# EAGLE design sensors (EAGLE 5.11)
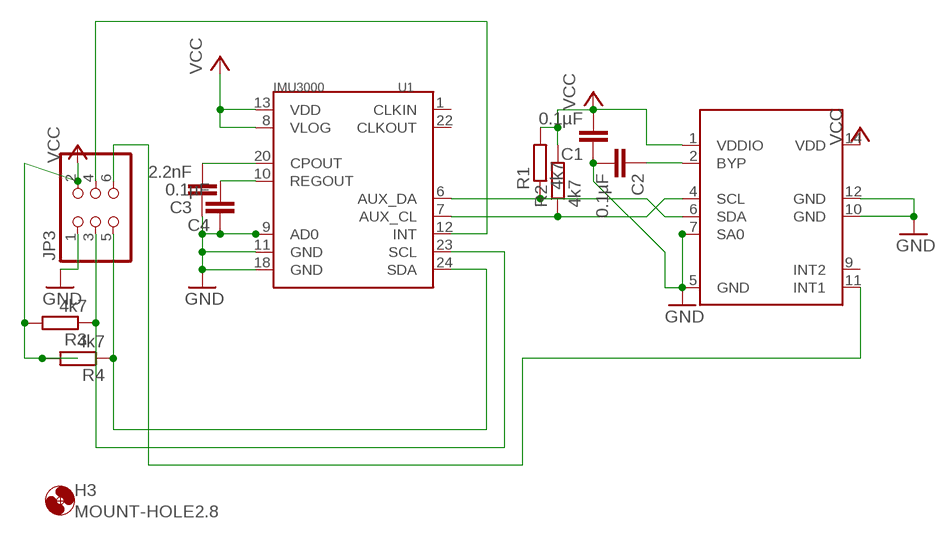
[diagram p0: schematic, sheet 1]

## Parts
C1  0.1µF  C-EUC0805  [C0805]
C2  0.1µF  C-EUC0805  [C0805]
C3  2.2nF  C-EUC0805  [C0805]
C4  0.1µF  C-EUC0805  [C0805]
H3  MOUNT-HOLE2.8  [2,8]
JP3  PINHD-2X3/90  [2X03/90]
R1  4k7  R-EU_R0805  [R0805]
R2  4k7  R-EU_R1206W  [R1206W]
R3  4k7  R-EU_R0805  [R0805]
R4  4k7  R-EU_R0805  [R0805]
U1  IMU3000  [QFN-24]
U2  MMA8451Q  [QFN16-4X4]

## Nets
GND: C1.1 C2.2 C3.1 C4.1 JP3.1 U1.9(AD0) U1.11(GND) U1.18(GND) U2.5(GND) U2.7(SA0) U2.10(GND) U2.12(GND)
N$1: R1.1 U1.6(AUX_DA) U2.6(SDA)
N$2: R2.1 U1.7(AUX_CL) U2.4(SCL)
N$4: C2.1 U2.2(BYP)
N$5: JP3.6 U2.11(INT1)
N$7: C3.2 U1.20(CPOUT)
N$8: C4.2 U1.10(REGOUT)
N$9: JP3.3 R3.1 U1.23(SCL)
N$10: JP3.5 R4.1 U1.24(SDA)
N$11: JP3.4 U1.12(INT)
VCC: C1.2 JP3.2 R1.2 R2.2 R3.2 R4.2 U1.8(VLOG) U1.13(VDD) U2.1(VDDIO) U2.14(VDD)
Unconnected: U1.1(CLKIN) U1.22(CLKOUT) U2.9(INT2)

## Library data of the parts
C1-C4 = rcl:C-EU: CAPACITOR, European symbol
H3 = holes:MOUNT-HOLE: MOUNTING HOLE with drill center marker
JP3 = pinhead:PINHD-2X3: PIN HEADER
R1-R4 = rcl:R-EU_: RESISTOR, European symbol
U1 = Quadro:IMU3000
U2 = Quadro:MMA8451Q

## Board
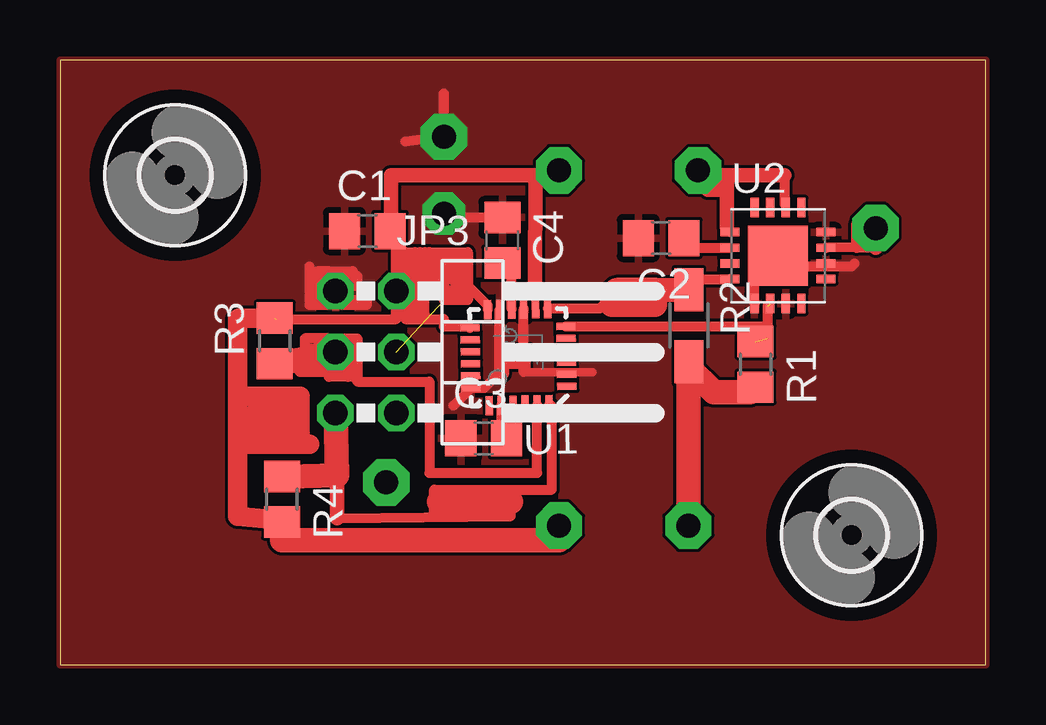
[diagram p1: board, top side]
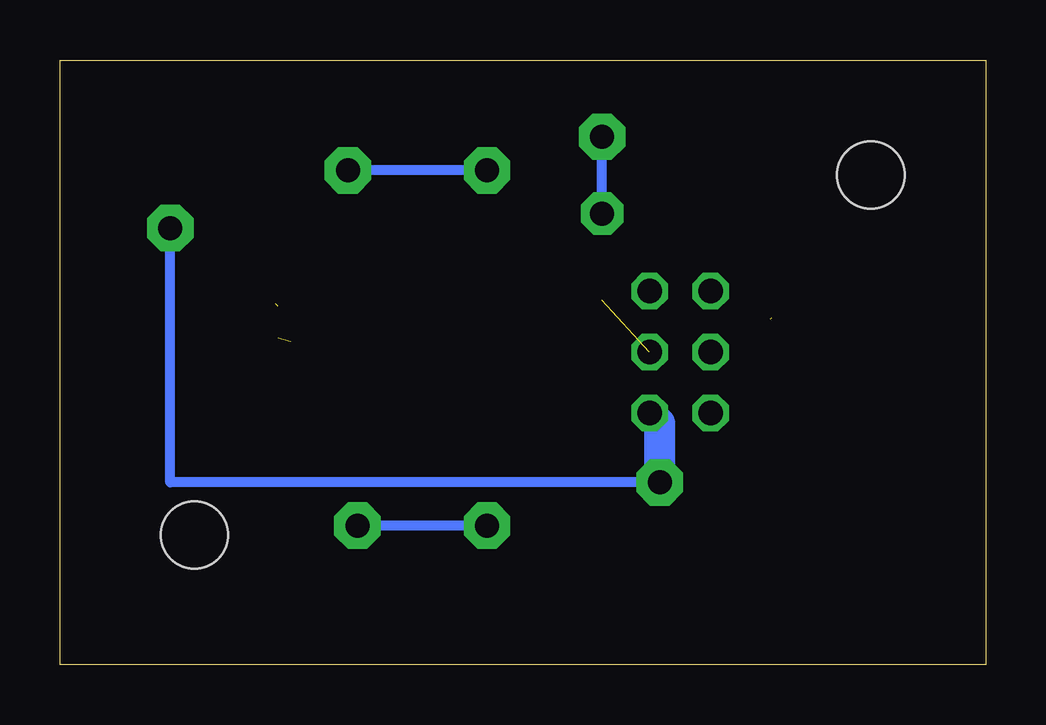
[diagram p2: board, bottom side, seen from below]

Size 38.6 x 25.2 mm. Coordinates in mm from the lower left corner, seen from the top.
Outline: 0,0 38.6,0 38.6,25.2 0,25.2 0,0
Copper layers (1*16): Top 0.035mm / dielectric 1.5mm / Bottom 0.035mm
Design rules "default *": minimum track width 10mil, minimum drill 24mil, track to track 5mil, track to pad 5mil, pad to pad 5mil, via to via 5mil, smd to smd 5mil, copper to edge 0mil, drill to drill 8mil, minimum pad ring 10mil, minimum via ring 8mil, stop-mask expansion 4mil, vias tented up to drill 0mil, thermal gap 10mil

### Footprints (pad centres in the part's own frame; a part is rotated, then mirrored left to right if it is on the bottom)
C0805 = smd 1.3 x 1.5: 1 -0.95,0; 2 0.95,0
2,8 = hole 2.8: 0,0
2X03/90 = drill 1.016 octagon: 1 -2.54,-6.35; 2 -2.54,-3.81; 3 0,-6.35; 4 0,-3.81; 5 2.54,-6.35; 6 2.54,-3.81
R0805 = smd 1.3 x 1.5: 1 -0.95,0; 2 0.95,0
R1206W = smd 1.8 x 1.2: 1 -1.499,0; 2 1.499,0
QFN-24 = smd 0.8 x 0.3: 1 -2,1.25; 2 -2,0.75; 3 -2,0.25; 4 -2,-0.25; 5 -2,-0.75; 6 -2,-1.25; 13 2,-1.25; 14 2,-0.75; 15 2,-0.25; 16 2,0.25; 17 2,0.75; 18 2,1.25 | smd 0.3 x 0.8: 7 -1.25,-2; 8 -0.75,-2; 9 -0.25,-2; 10 0.25,-2; 11 0.75,-2; 12 1.25,-2; 19 1.25,2; 20 0.75,2; 21 0.25,2; 22 -0.25,2; 23 -0.75,2; 24 -1.25,2
QFN16-4X4 = smd 0.8 x 0.35: 1 -2,0.975; 2 -2,0.325; 3 -2,-0.325; 4 -2,-0.975; 9 2,-0.975; 10 2,-0.325; 11 2,0.325; 12 2,0.975 | smd 0.35 x 0.8: 5 -0.975,-2; 6 -0.325,-2; 7 0.325,-2; 8 0.975,-2; 13 0.975,2; 14 0.325,2; 15 -0.325,2; 16 -0.975,2 | smd 2.5 x 2.5: EXP 0,0

### Placement (x,y rotation side)
C1  12.81,18.07 0 top
C2  25.06,17.78 180 top
C3  17.66,9.43 0 top
C4  18.44,17.69 270 top
H2  MOUNT-HOLE2.8  [2,8]  4.8,20.4 0 top
H3  33,5.4 0 top
JP3  17.83,13.03 270 top
R1  28.99,12.52 270 top
R2  26.22,14.13 270 top
R3  8.95,13.5 90 top
R4  9.25,6.9 270 top
U1  19.11,12.82 180.9 top
U2  29.93,17.05 0 top

### Tracks (layer width: path | path; a pad name or v marks a point on that pad's centre or on a via)
GND  (via drill 1 pad 1.78, 1 pad 1.93)
  Top 0.35: 19.33,12.2 22.2,12.2
  Top 0.406: U1.11 18.33,12.18 17.69,11.54 U1.18 16.4,10.8 | 19.33,12.2 U1.9 | JP3.1 11.2,15.57 11.2,16.4 10.8,16.4 10.8,15.8 10.6,15.8 10.6,15.6 10.4,15.6 10.4,16.4 12.2,16.4 12.2,15.8 12.4,15.8 12.4,16.2 12,16.2 12,15.8 10.4,15.8 10.4,15 12.8,15 12.8,15.2 10.6,15.2 10.6,15.4 10.4,16.6 | 33.12,16.73 33,16.6 29,16.6 28.95,16.55 U2.5 | v16,22 16,23.6 | v16,22 16,23.8 | v16,22 14.4,21.8 | v16,18.8 16,18.64 C4.1
  Bottom 0.406: v16,18.8 v16,22
  pour Top: 0,25.2 38.6,25.2 38.6,0 0,0
N$1  (2 unrouted)
  Top 0.406: 29.5,14.1 29.5,14.95 | 29.5,14.1 29.5,13.6 | U1.6 29.5,14.1
N$2
  Top 0.406: U2.4 26.67,16.07 R2.1 | 23.28,15.63 22.5,14.85 U1.7
  Top 1.016: 23.28,15.63 24.8,15.63 24.8,15 23.2,15 | 23.2,15 23,15 | 23.2,15 23.2,15.6 25.2,15.6 R2.1
N$3
  Top 0.406: 18.5,13.1 18.5,12.1
N$4
  Top 0.406: C2.1 26.01,17.37 U2.2
N$5  (via drill 1 pad 1.93)
  Top 0.406: 34,17.37 33.2,17.37 33.2,17.4 | 33.2,17.4 33.2,18.4 | 33.2,17.4 U2.11
  Top 0.61: v34,18.2 34,17.37
  Bottom 0.406: v13.6,7.6 34,7.6 v34,18.2
  Bottom 1.3: JP3.6 13.6,10.07 v13.6,7.6
N$7
  Top 0.406: C3.2 18.39,9.41 U1.20
N$8
  Top 0.406: C4.2 18.83,16.74 U1.10
N$9
  Top 0.406: 11.44,12.95 arc-90 JP3.3 | U1.23 19.89,8 15.4,8 15.4,11.8 13.6,11.79 12.4,11.8 12.4,12.4 | JP3.3 12.4,13.03 | JP3.3 11.2,13.03 11.2,12.4 12.4,12.4 | 12.4,12.4 12.4,13 12,13 12,12 11.2,12 11.2,12.2 | 11.2,12.2 11.2,12.8 | 11.2,12.2 10,12.2 | 11.2,12.2 12.2,12.2 12.2,12 12.4,12 12.4,13.6 11.4,13.6 11.4,13.4 | 11.4,13.4 12.2,13.4 12.2,13.2 | 12.2,13.2 11.2,13.2 11.2,13.6 10.2,13.6 10.2,13.2 10.8,13.2 10.8,13.4 11.4,13.4 | 12.2,13.2 12.2,12.4 12.4,12.4
  Top 1.016: R3.1 11.44,12.95
N$10
  Top 0.406: R4.1 arc90 9.46,7.84 | U1.24 arc-90 20.5,10.73 20.5,7.3 15.6,7.3 15.6,6.2 15.8,6.2 15.8,6.8 | 11.55,6.1 18.8,6.2 18.8,7.2 18.8,6.8 18.8,6.6
  Top 0.61: 11.56,7.9 11.55,7.7 11.55,6.1
  Top 1.016: 9.46,7.84 11.56,7.9 JP3.5 | 18.8,6.8 15.8,6.8
N$11  (1 unrouted)
  Top 0.406: U1.12 17.83,14.97 16.8,16 | 16.8,16 16.4,16 16.4,16.6 16.8,16.6 16.8,16 | 16.8,16 16.8,15.6 16,15.6 | 16,15.6 16,16.8 17,16.8 | 17,16.8 17,15.2 16,15.2 16,15.6 | 16,15.6 15.6,15.6 15.6,17 17,17 | 17,17 17,16.8 | 17,17 17,17.2 15.4,17.2 15.4,16
VCC  (via drill 1 pad 1.93)  (1 unrouted)
  Top 0.254: R2.2 26.37,11.97
  Top 0.305: U2.14 30.25,19.2 30.2,19.2 | 19.8,15.8 19.8,14.83 U1.8
  Top 0.406: 14.4,15.57 14.53,15.57 | 14.4,15.57 14.4,14.4 15,14.4 | 14.4,15.57 14.4,17.2 14.8,17.2 14.8,14.6 15.2,14.6 15.2,17.2 15,17.2 15,14.4 | 15,14.4 16,14.4 16,14.1 17.03,14.1 U1.13 | 26.22,12.38 R2.2 26.2,12.63 | 28.77,11.35 R1.2 | JP3.2 14,15.57 14,17.8 13.76,17.8 C1.2 13.8,18.07 | JP3.2 14.4,15.57 | JP3.2 14.02,14.4 9,14.4 | 30.2,20.4 30.2,19.2 | 27.8,18.23 U2.1 | 19.83,20.4 20.8,20.4 v20.8,20.6 | v26.6,20.6 26.8,20.4
  Top 0.61: 9.4,6 9.25,5.2 | 7.4,14.4 7.45,14.45 | 13.8,18.07 13.8,20.4 19.83,20.4 19.8,15.8 | 27,20.4 30.2,20.4 | 27,20.4 27,19.8 27.8,19.8 27.8,20.2 27.8,18.23 | 26.8,20.4 27,20.4
  Top 0.813: 9.4,6 7.4,6.2 7.4,10 | 7.4,10 8.2,10 | 8.2,10 10,10 | 8.2,10 8.2,10.6 10,10.6 10,9.4 7.8,9.4 7.8,9.2 10,9.2 | 10,9.2 10.4,9.2 | 10,9.2 10,11.2 7.4,11.2 | 7.4,10 7.4,11.2 | 7.4,11.2 7.4,14.4 | 7.45,14.45 R3.2
  Top 1.016: 26.22,12.38 27.25,11.35 28.77,11.35 | R4.2 9.25,5.2 20.8,5.2 v20.8,5.8 | v26.2,5.8 26.2,12.63
  Bottom 0.406: v20.8,5.8 v26.2,5.8 | v20.8,20.6 v26.6,20.6